# EAGLE design ice drifter 6 (EAGLE 9.3.1)
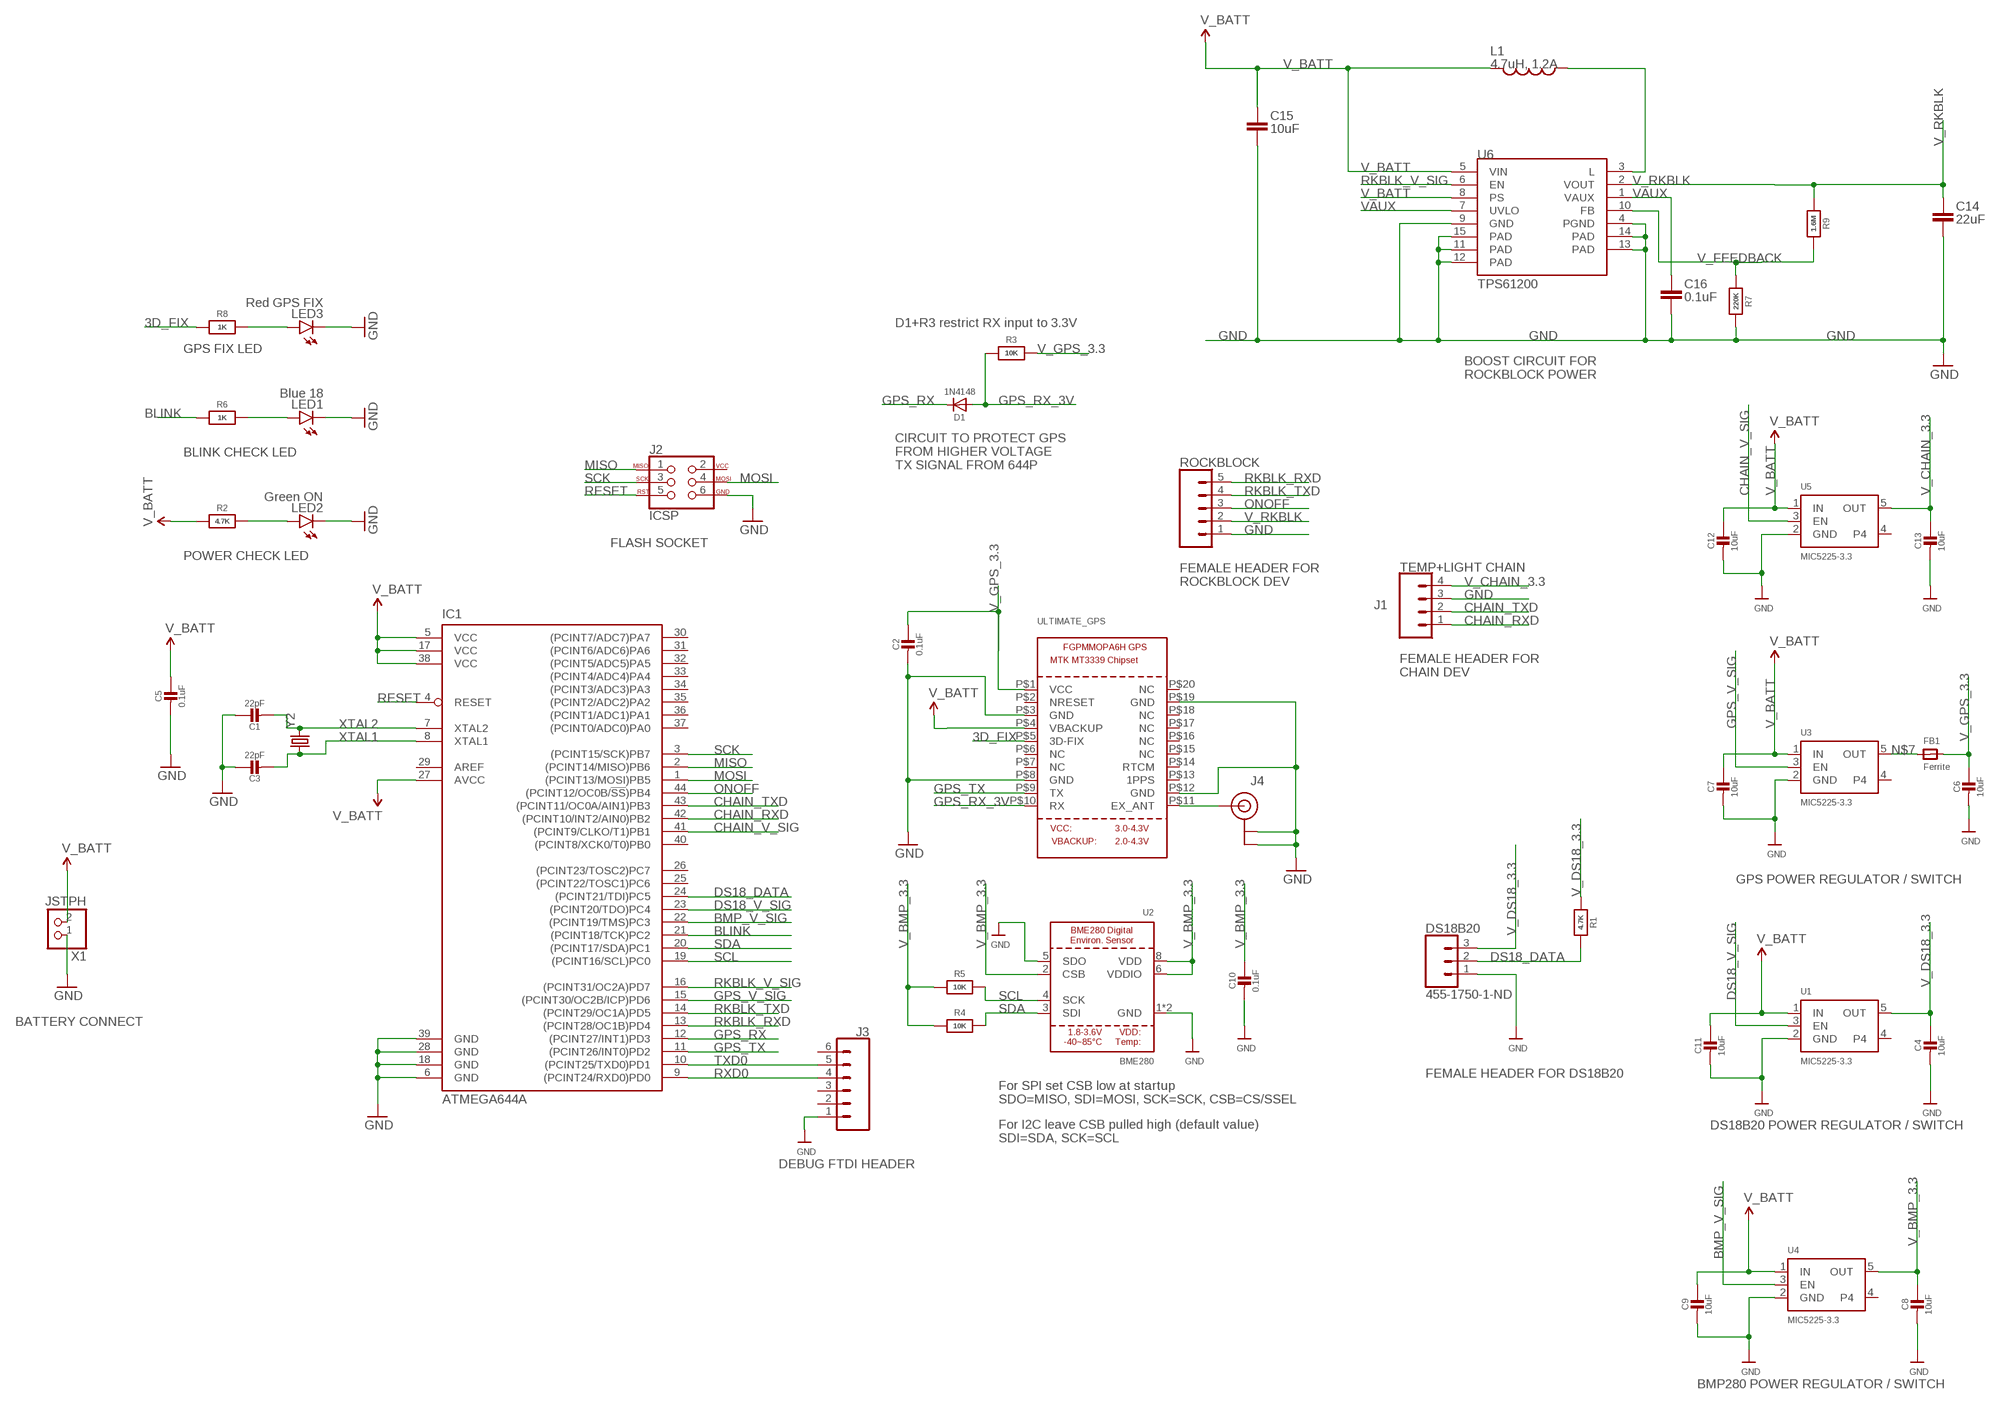
[diagram p0: schematic, sheet 1]

## Parts
C1  22pF  CAP_CERAMIC0805-NOOUTLINE  [0805-NO@2]
C2  0.1uF  CAP_CERAMIC0805-NOOUTLINE  [0805-NO@2]
C3  22pF  CAP_CERAMIC0805-NOOUTLINE  [0805-NO@2]
C4  10uF  CAP_CERAMIC0805-NOOUTLINE  [0805-NO@2]
C5  0.1uF  CAP_CERAMIC0805-NOOUTLINE  [0805-NO@2]
C6  10uF  CAP_CERAMIC0805-NOOUTLINE  [0805-NO@2]
C7  10uF  CAP_CERAMIC0805-NOOUTLINE  [0805-NO@2]
C8  10uF  CAP_CERAMIC0805-NOOUTLINE  [0805-NO@2]
C9  10uF  CAP_CERAMIC0805-NOOUTLINE  [0805-NO@2]
C10  0.1uF  CAP_CERAMIC0805-NOOUTLINE  [0805-NO@2]
C11  10uF  CAP_CERAMIC0805-NOOUTLINE  [0805-NO@2]
C12  10uF  CAP_CERAMIC0805-NOOUTLINE  [0805-NO@2]
C13  10uF  CAP_CERAMIC0805-NOOUTLINE  [0805-NO@2]
C14  22uF  CAP0805  [0805]
C15  10uF  CAP1206  [1206]
C16  0.1uF  CAP0805  [0805]
D1  1N4148  DIODESOD-323  [SOD-323]
DS18B20  455-1750-1-ND  CONN_03  [1X03]
FB1  Ferrite  FERRITE-0805NO  [0805-NO@1]
IC1  ATMEGA644A  [TQFP44]
J1  TEMP+LIGHT CHAIN  CONN_04  [1X04]
J2  ICSP  AVR_SPI_PROG_3X2NS  [2X3-NS]
J3  CONN_06SILK_FEMALE_PTH  [1X06]
J4  U.FL  [U.FL]
L1  4.7uH, 1.2A  INDUCTOR.  [CDRH2D09]
LED1  Blue 18  LED1206  [LED-1206]
LED2  Green ON  LED1206  [LED-1206]
LED3  Red GPS FIX  LED1206  [LED-1206]
R1  4.7K  RESISTOR0805_NOOUTLINE  [0805-NO]
R2  4.7K  RESISTOR0805_NOOUTLINE  [0805-NO]
R3  10K  RESISTOR0805_NOOUTLINE  [0805-NO]
R4  10K  RESISTOR0805_NOOUTLINE  [0805-NO]
R5  10K  RESISTOR0805_NOOUTLINE  [0805-NO]
R6  1K  RESISTOR0805_NOOUTLINE  [0805-NO]
R7  220K  RESISTOR0805_NOOUTLINE  [0805-NO]
R8  1K  RESISTOR0805_NOOUTLINE  [0805-NO]
R9  1.6M  RESISTOR0805_NOOUTLINE  [0805-NO]
ROCKBLOCK  CONN_05  [1X05]
U1  MIC5225-3.3  VREG_SOT23-5  [SOT23-5]
U2  BME280  [BME280]
U3  MIC5225-3.3  VREG_SOT23-5  [SOT23-5]
U4  MIC5225-3.3  VREG_SOT23-5  [SOT23-5]
U5  MIC5225-3.3  VREG_SOT23-5  [SOT23-5]
U6  TPS61200  [QFN-10_PAD]
ULTIMATE_GPS  GPS_FGPMMOPA6H  [FGPMMOPA6H]
X1  JSTPH  CON_JST_PH_2PIN  [JSTPH2]
Y2  CRYSTALTXC-7A  [CRYSTAL-TXC-7A]

## Nets
3D_FIX: R8.1 ULTIMATE_GPS.P$5(3D-FIX)
BLINK [signal]: IC1.21((PCINT18/TCK)PC2) R6.1
BMP_V_SIG [signal]: IC1.22((PCINT19/TMS)PC3) U4.3(EN)
CHAIN_RXD [signal]: IC1.42((PCINT10/INT2/AIN0)PB2) J1.1
CHAIN_TXD [signal]: IC1.43((PCINT11/OC0A/AIN1)PB3) J1.2
CHAIN_V_SIG [signal]: IC1.41((PCINT9/CLKO/T1)PB1) U5.3(EN)
COIL: L1.P$1 U6.3(L)
DS18_DATA [signal]: DS18B20.2 IC1.24((PCINT21/TDI)PC5) R1.2
DS18_V_SIG [signal]: IC1.23((PCINT20/TDO)PC4) U1.3(EN)
GND [ground]: C1.1 C2.2 C3.1 C4.2 C5.2 C6.2 C7.2 C8.2 C9.2 C10.2 C11.2 C12.2 C13.2 C14.2 C15.2 C16.2 DS18B20.1 IC1.6(GND) IC1.18(GND) IC1.28(GND) IC1.39(GND) J1.3 J2.6 J3.1 J4.1(GND) J4.2(GND) LED1.C LED2.C LED3.C R7.2 ROCKBLOCK.1 U1.2(GND) U2.1(GND) U2.5(SDO) U2.7(GND) U3.2(GND) U4.2(GND) U5.2(GND) U6.4(PGND) U6.9(GND) U6.11(PAD) U6.12(PAD) U6.13(PAD) U6.14(PAD) U6.15(PAD) ULTIMATE_GPS.P$3(GND) ULTIMATE_GPS.P$8(GND) ULTIMATE_GPS.P$12(GND) ULTIMATE_GPS.P$19(GND) X1.1
GPS_RX [signal]: D1.C IC1.12((PCINT27/INT1)PD3)
GPS_RX_3V: D1.A R3.1 ULTIMATE_GPS.P$10(RX)
GPS_TX [signal]: IC1.11((PCINT26/INT0)PD2) ULTIMATE_GPS.P$9(TX)
GPS_V_SIG [signal]: IC1.15((PCINT30/OC2B/ICP)PD6) U3.3(EN)
MISO [signal]: IC1.2((PCINT14/MISO)PB6) J2.1
MOSI [signal]: IC1.1((PCINT13/MOSI)PB5) J2.4
N$1: LED2.A R2.2
N$2 [signal]: LED1.A R6.2
N$3: LED3.A R8.2
N$7: FB1.1 U3.5(OUT)
ONOFF [signal]: IC1.44((PCINT12/OC0B/!SS!)PB4) ROCKBLOCK.3
RESET [signal]: IC1.4(RESET) J2.5
RKBLK_RXD [signal]: IC1.13((PCINT28/OC1B)PD4) ROCKBLOCK.5
RKBLK_TXD [signal]: IC1.14((PCINT29/OC1A)PD5) ROCKBLOCK.4
RKBLK_V_SIG [signal]: IC1.16((PCINT31/OC2A)PD7) U6.6(EN)
RXD0 [signal]: IC1.9((PCINT24/RXD0)PD0) J3.4
SCK [signal]: IC1.3((PCINT15/SCK)PB7) J2.3
SCL [signal]: IC1.19((PCINT16/SCL)PC0) R5.2 U2.4(SCK)
SDA [signal]: IC1.20((PCINT17/SDA)PC1) R4.2 U2.3(SDI)
TXD0 [signal]: IC1.10((PCINT25/TXD0)PD1) J3.5
U.FL_ANT: J4.FEED(SIGNAL) ULTIMATE_GPS.P$11(EX_ANT)
V_BATT: C5.1 C7.1 C9.1 C11.1 C12.1 C15.1 IC1.5(VCC) IC1.17(VCC) IC1.27(AVCC) IC1.38(VCC) L1.P$2 R2.1 U1.1(IN) U3.1(IN) U4.1(IN) U5.1(IN) U6.5(VIN) U6.8(PS) ULTIMATE_GPS.P$4(VBACKUP) X1.2
V_BMP_3.3: C8.1 C10.1 R4.1 R5.1 U2.2(CSB) U2.6(VDDIO) U2.8(VDD) U4.5(OUT)
V_CHAIN_3.3: C13.1 J1.4 U5.5(OUT)
V_DS18_3.3: C4.1 DS18B20.3 R1.1 U1.5(OUT)
V_FEEDBACK: R7.1 R9.2 U6.10(FB)
V_GPS_3.3: C2.1 C6.1 FB1.2 R3.2 ULTIMATE_GPS.P$1(VCC)
V_RKBLK: C14.1 R9.1 ROCKBLOCK.2 U6.2(VOUT)
VAUX: C16.1 U6.1(VAUX) U6.7(UVLO)
XTAL1 [signal]: C3.2 IC1.8(XTAL1) Y2.P$1
XTAL2 [signal]: C1.2 IC1.7(XTAL2) Y2.P$2
Unconnected: IC1.25((PCINT22/TOSC1)PC6) IC1.26((PCINT23/TOSC2)PC7) IC1.29(AREF) IC1.30((PCINT7/ADC7)PA7) IC1.31((PCINT6/ADC6)PA6) IC1.32((PCINT5/ADC5)PA5) IC1.33((PCINT4/ADC4)PA4) IC1.34((PCINT3/ADC3)PA3) IC1.35((PCINT2/ADC2)PA2) IC1.36((PCINT1/ADC1)PA1) IC1.37((PCINT0/ADC0)PA0) IC1.40((PCINT8/XCK0/T0)PB0) J2.2 J3.2 J3.3 J3.6 U1.4 U3.4 U4.4 U5.4 ULTIMATE_GPS.P$2(NRESET) ULTIMATE_GPS.P$6(NC) ULTIMATE_GPS.P$7(NC) ULTIMATE_GPS.P$13(1PPS) ULTIMATE_GPS.P$14(RTCM) ULTIMATE_GPS.P$15(NC) ULTIMATE_GPS.P$16(NC) ULTIMATE_GPS.P$17(NC) ULTIMATE_GPS.P$18(NC) ULTIMATE_GPS.P$20(NC)

## Notes on the sheet
- D1+R3 restrict RX input to 3.3V
- GPS FIX LED
- BOOST CIRCUIT FOR 
  ROCKBLOCK POWER
- BLINK CHECK LED
- CIRCUIT TO PROTECT GPS 
  FROM HIGHER VOLTAGE 
  TX SIGNAL FROM 644P
- FLASH SOCKET
- POWER CHECK LED
- FEMALE HEADER FOR 
  ROCKBLOCK DEV
- FEMALE HEADER FOR 
  CHAIN DEV
- GPS POWER REGULATOR / SWITCH
- BATTERY CONNECT
- FEMALE HEADER FOR DS18B20
- For SPI set CSB low at startup
  SDO=MISO, SDI=MOSI, SCK=SCK, CSB=CS/SSEL
- DS18B20 POWER REGULATOR / SWITCH
- For I2C leave CSB pulled high (default value)
  SDI=SDA, SCK=SCL
- DEBUG FTDI HEADER
- BMP280 POWER REGULATOR / SWITCH

## Library data of the parts
C1-C13 = microbuilder:CAP_CERAMIC: Ceramic Capacitors For new designs, use the packages preceded by an '_' character since they are more reliable: The following footprints should be used on most boards: _0402 - Standard footprint for regular board layouts _0603 - Standard footprint for regular board layouts _0805 - Standard footprint for regular board layouts _1206 - Standard footprint for regular board layouts For extremely tight-pitch boards where space is at a premium, the following 'micro-pitch' footprints can be used (smaller pads, no silkscreen outline, etc.): _0402MP - Micro-pitch footprint for very dense/compact boards _0603MP - Micro-pitch footprint for very dense/compact boards _0805MP - Micro-pitch footprint for very dense/compact boards _1206MP - Micro-pitch footprint for very dense/compact boards
C14-C16 = CH_passive:CAP: Capacitor Standard 0603 ceramic capacitor, and 0.1" leaded capacitor.
D1 = microbuilder:DIODE: Diode SMA Model Volts Amps Type Vf Ir Digikey # Notes SSA34-E3 40V 3A Schottky 480mV @ 3A 200uA @ 40V SSA34-E3/61TGITR-ND CDBA120-G 20V 1A Schottky 500mV @ 1A 500uA @ 20V 641-1014-6-ND REEL MBRA210 10V 2A Schottky 350mV @ 2A 700uA @ 10V MBRA210LT3 SOD-123 Model Volts Amps Type Vf Ir Order # Notes BAT54T1G 30V 200mA Schottky 800mV @ 200mA 2uA @ 25V BAT54T1GOSTR-ND B0530W 30V 500mA Schottky 430mV @ 500mA 130uA @ 30V B0530W-FDICT-ND REEL MBR120 20V 1A Schottky 340mV @ 1A MBR120VLSFT1GOSCT-ND SOD-323 Model Volts Amps Type Vf Ir Order # Notes PMEG2005EJ 20V 500mA Schottky 355mV @ 500mA 568-4110-1-ND ZLLS410 10V 570mA Schottky 380mV @ 570mA ZLLS410CT-ND 1N4148WS 75V 150mA Silicon/Simple 1V 1N4148WSFSCT-ND REEL SOD-523 Model Volts Amps Type Vf Ir Order # Notes BAT54XV2 30V 200mA Schottky 0.8V @ 100mA BAT54XV2CT-ND TB751S 30V 30mA Schottky RB751S-40TE61CT-ND SOT23-R/W (R = Solder Paste/Reflow Ovens, W = Hand-Soldering) Model Volts Amps Type Vf Ir Order # Notes BAT54FILM 40V 300mA Schottky 497-7162-1-ND POWERDI-5 Model Volts Amps Type Vf Ir Order # Notes PDS560 60V 5A Schottky 670mV @ 5A 150uA @ 60V PDS560DICT-ND
DS18B20 = SparkFun-Connectors:CONN_03: Multi connection point. Often used as Generic Header-pin footprint for 0.1 inch spaced/style header connections On any of the 0.1 inch spaced packages, you can populate with these: Break Away Headers - Straight <https://www.sparkfun.com/products/116> (PRT-00116) Break Away Male Headers - Right Angle <https://www.sparkfun.com/products/553> (PRT-00553) Female Headers <https://www.sparkfun.com/products/115> (PRT-00115) Break Away Headers - Machine Pin <https://www.sparkfun.com/products/117> (PRT-00117) Break Away Female Headers - Swiss Machine Pin <https://www.sparkfun.com/products/743> (PRT-00743) Stackable Header - 3 Pin (Female, 0.1") <https://www.sparkfun.com/products/13875> (PRT-13875) For SCREWTERMINALS and SPRING TERMINALS visit here: Screw Terimnals on SparkFun.com <https://www.sparkfun.com/search/results?term=Screw+Terminals> (5mm/3.5mm/2.54mm spacing) This device is also useful as a general connection point to wire up your design to another part of your project. Our various solder wires solder well into these plated through hole pads. Hook-Up Wire - Assortment (Stranded, 22 AWG) <https://www.sparkfun.com/products/11375> (PRT-11375) Hook-Up Wire - Assortment (Solid Core, 22 AWG) <https://www.sparkfun.com/products/11367> (PRT-11367) View the entire wire category on our website here <https://www.sparkfun.com/categories/141> Special notes: Molex polarized connector foot print use with SKU : PRT-08232 with associated crimp pins and housings.; PROD_ID: XXX-00000
FB1 = microbuilder:FERRITE: Ferrite Bead 0603 MMZ1608B121C - 120 Ohm @ 100MHz, 600mA, 0.15 Ohm DC Resistance - Digikey: 445-2164-1-ND BK1608HW121-T - 120 Ohm, 600mA Ferrite Chip - Digikey: 587-1876-2-ND 0805 HZ0805B272R-10 - 2.7K Ohm @ 100MHz, 200mA, 0.8 Ohm DC Resistance - Digikey: 240-2504-1-ND (see also Murata BLM21BD272SN1L) MMZ2012Y152B - 1.5K Ohm @ 100MHz, 500mA, 0.4 Ohm DC Resistance - Digikey: 445-1560-1-ND - Mainly for high frequency (80-400MHz) MMZ2012R102A - 1K Ohm @ 100MHz, 500mA, 0.3 Ohm DC Resistance - Digikey: 445-1555-2-ND - More general purpose (10-200MHz)
IC1 = atmel:ATMEGA644: 8-bit Microcontroller with 64K Bytes In-System Programmable Flash Source: http://www.atmel.com/dyn/resources/prod_documents/doc2593.pdf; MPN: ATMEGA644PV-10AU; OC_FARNELL: 1455123; OC_NEWARK: 58M3748
J1 = SparkFun-Connectors:CONN_04: Multi connection point. Often used as Generic Header-pin footprint for 0.1 inch spaced/style header connections On any of the 0.1 inch spaced packages, you can populate with these: Break Away Headers - Straight <https://www.sparkfun.com/products/116> (PRT-00116) Break Away Male Headers - Right Angle <https://www.sparkfun.com/products/553> (PRT-00553) Female Headers <https://www.sparkfun.com/products/115> (PRT-00115) Break Away Headers - Machine Pin <https://www.sparkfun.com/products/117> (PRT-00117) Break Away Female Headers - Swiss Machine Pin <https://www.sparkfun.com/products/743> (PRT-00743) For SCREWTERMINALS and SPRING TERMINALS visit here: Screw Terimnals on SparkFun.com <https://www.sparkfun.com/search/results?term=Screw+Terminals> (5mm/3.5mm/2.54mm spacing) This device is also useful as a general connection point to wire up your design to another part of your project. Our various solder wires solder well into these plated through hole pads. Hook-Up Wire - Assortment (Stranded, 22 AWG) <https://www.sparkfun.com/products/11375> (PRT-11375) Hook-Up Wire - Assortment (Solid Core, 22 AWG) <https://www.sparkfun.com/products/11367> (PRT-11367) View the entire wire category on our website here <https://www.sparkfun.com/categories/141> Special notes: Molex polarized connector foot print use with SKU : PRT-08231 with associated crimp pins and housings. 1MM SMD Version SKU: PRT-10208; PROD_ID: CONN-09696
J2 = SparkFun-Connectors:AVR_SPI_PROG_3X2: AVR ISP 6 Pin This is the reduced ISP connector for AVR programming. Common on Arduino. This footprint will take up less PCB space and can be used with a 10-pin to 6-pin adapter such as SKU: BOB-08508 **Special note about "TEST_POINT" package. The stop mask is on the top side, so if you want your programming test points to be on the bottom of your board, make sure to place this package on the bottom side of the board. This also ensure that the orientation to program from the bottom side will be correct. SparkFun Products: SparkFun ISP Pogo Adapter <https://www.sparkfun.com/products/11591> - NS Tiny AVR Programmer <https://www.sparkfun.com/products/11801> -PTH
J3 = SparkFun-Connectors:CONN_06: Multi connection point. Often used as Generic Header-pin footprint for 0.1 inch spaced/style header connections On any of the 0.1 inch spaced packages, you can populate with these: Break Away Headers - Straight <https://www.sparkfun.com/products/116> (PRT-00116) Break Away Male Headers - Right Angle <https://www.sparkfun.com/products/553> (PRT-00553) Female Headers <https://www.sparkfun.com/products/115> (PRT-00115) Break Away Headers - Machine Pin <https://www.sparkfun.com/products/117> (PRT-00117) Break Away Female Headers - Swiss Machine Pin <https://www.sparkfun.com/products/743> (PRT-00743) Arduino Stackable Header - 6 Pin <https://www.sparkfun.com/products/9280> (PRT-09280) For SCREWTERMINALS and SPRING TERMINALS visit here: Screw Terimnals on SparkFun.com <https://www.sparkfun.com/search/results?term=Screw+Terminals> (5mm/3.5mm/2.54mm spacing) This device is also useful as a general connection point to wire up your design to another part of your project. Our various solder wires solder well into these plated through hole pads. Hook-Up Wire - Assortment (Stranded, 22 AWG) <https://www.sparkfun.com/products/11375> (PRT-11375) Hook-Up Wire - Assortment (Solid Core, 22 AWG) <https://www.sparkfun.com/products/11367> (PRT-11367) View the entire wire category on our website here <https://www.sparkfun.com/categories/141>; PROD_ID: CONN-08437
J4 = SparkFun-Connectors:U.FL: SMD Antenna Connector - U.FL 2mm height, 3.0mm x 3.0mm receptacle size. SparkFun Products: SparkFun WiFi Shield - ESP8266 <https://www.sparkfun.com/products/13287> SparkFun ESP8266 Thing <https://www.sparkfun.com/products/13231> SparkFun MiniGen - Pro Mini Signal Generator Shield <https://www.sparkfun.com/products/11420>; PROD_ID: CONN-09193; SF_ID: WRL-09144
L1 = SparkFun:INDUCTOR: Inductors Basic Inductor/Choke - 0603 and 1206. Footprints are not proven and vary greatly between part numbers.
LED1 LED3 = SparkFun-LED:LED: LEDs Standard schematic elements and footprints for 5mm, 3mm, 1206, and 0603 sized LEDs. 5mm - Spark Fun Electronics SKU : COM-00529 (and others); PROD_ID: DIO-09911
LED2 = SparkFun-LED:LED: LEDs Standard schematic elements and footprints for 5mm, 3mm, 1206, and 0603 sized LEDs. 5mm - Spark Fun Electronics SKU : COM-00529 (and others); PROD_ID: DIO-09910
R1-R9 = microbuilder:RESISTOR: Resistors For new designs, use the packages preceded by an '_' character since they are more reliable: The following footprints should be used on most boards: _0402 - Standard footprint for regular board layouts _0603 - Standard footprint for regular board layouts _0805 - Standard footprint for regular board layouts _1206 - Standard footprint for regular board layouts For extremely tight-pitch boards where space is at a premium, the following 'micro-pitch' footprints can be used (smaller pads, no silkscreen outline, etc.): _0402MP - Micro-pitch footprint for very dense/compact boards _0603MP - Micro-pitch footprint for very dense/compact boards _0805MP - Micro-pitch footprint for very dense/compact boards _1206MP - Micro-pitch footprint for very dense/compact boards
ROCKBLOCK = SparkFun-Connectors:CONN_05: Multi connection point. Often used as Generic Header-pin footprint for 0.1 inch spaced/style header connections On any of the 0.1 inch spaced packages, you can populate with these: Break Away Headers - Straight <https://www.sparkfun.com/products/116> (PRT-00116) Break Away Male Headers - Right Angle <https://www.sparkfun.com/products/553> (PRT-00553) Female Headers <https://www.sparkfun.com/products/115> (PRT-00115) Break Away Headers - Machine Pin <https://www.sparkfun.com/products/117> (PRT-00117) Break Away Female Headers - Swiss Machine Pin <https://www.sparkfun.com/products/743> (PRT-00743) For SCREWTERMINALS and SPRING TERMINALS visit here: Screw Terimnals on SparkFun.com <https://www.sparkfun.com/search/results?term=Screw+Terminals> (5mm/3.5mm/2.54mm spacing) This device is also useful as a general connection point to wire up your design to another part of your project. Our various solder wires solder well into these plated through hole pads. Hook-Up Wire - Assortment (Stranded, 22 AWG) <https://www.sparkfun.com/products/11375> (PRT-11375) Hook-Up Wire - Assortment (Solid Core, 22 AWG) <https://www.sparkfun.com/products/11367> (PRT-11367) View the entire wire category on our website here <https://www.sparkfun.com/categories/141> Special notes: Molex polarized connector foot print use with SKU : PRT-08231 with associated crimp pins and housings. 1MM SMD Version SKU: PRT-10208
U1 U3-U5 = microbuilder:VREG_SOT23-5: SOT23-5 Fixed Voltage Regulators Part Current Out V Out V In V Dropout θJA (°C/W) TJ (°C) Digikey Part No. ADP121 150mA 3.3V 3.4-5.5V 0.09V @ 150mA -- -- ADP121-AUJZ33R7CT-ND ADP121 150mA 3.0V 3.1-5.5V 0.09V @ 150mA -- -- ADP121-AUJZ30R7CT-ND ADP122 300mA 3.3V 3.4-5.5V 0.085V @ 300mA -- -- ADP122AUJZ-3.3-R7CT-ND ADP1712 300mA 3.3V 3.5-5.5V 0.17V @ 300mA -- -- ADP1712AUJZ-3.3-R7TR-ND AP7311 (Low Cost) 150mA 3.3V 3.5-6V 0.15V @ 150mA -- -- AP7311-33WG-7DICT-ND LD39015M18R 150mA 1.8V 1.9V-5.5V 0.08V @ 100mA -- -- 497-6977-1-ND LP2985A-33DBVR 150mA 3.3V 3.3-16V 0.28V @ 150mA 206 150 296-18479-1-ND MCP1824T-3302E/OT 300mA 3.3V 3.5V-6V 0.2V @ 300mA -- -- MCP1824T-3302E/OTCT-ND MIC5205-2.5YM5 TR 150mA 2.5V 2.7-16V 0.165V @ 150mA -- -- 576-1257-2-ND MIC5205-3.0YM5 TR 150mA 3.0V 3.2V-16V 0.165V @ 150mA -- -- 576-1258-2-ND MIC5205-3.3YM5 TR 150mA 3.3V 3.5V-16V 0.165V @ 150mA -- -- 576-1259-2-ND TPS780330220 150mA 3.3V+2.2V 3.6-5.5V 250mV Max -- -- 296-23332-1-ND TDA3663/N1,135 100mA 3.3V 3.5-45V 0.18V @ 50mA -- -- 568-5343-1-ND Max operating temp can be calculated using θJA, TJ (max junction temperature), and power in watts. Set the "Maximum Ambient Temperature" until it reaches TJ ("Max Junction Temperature"), which is the absolute limit for safe use of the regulator: Heat Sink Temperature Calculator <http://www.daycounter.com/Calculators/Heat-Sink-Temperature-Calculator.phtml> For example, With 12V source into a 3.3V LP2985 and a 30mA load, we are dissipating (12V-3.3V) * 0.03A = 0.261W. With a θJA of 206 °C/W, a TJ of 150°C, and 261mW we can safely use the chip without a heat sink up to 75°C (=147.1°C Junction Temperature).
U2 = microbuilder:BME280: BME280 - Environmental Sensor (I2C + SPI)
U6 = SparkFun:TPS61200: DC to DC Booster
ULTIMATE_GPS = adafruit:GPS_FGPMMOPA6H: GPS Module - MTK MT3339 Chipset, -165dBm sensitivity, 22 channels, 10Hz, auto-select external antenna options
X1 = microbuilder:CON_JST_PH_2PIN: JST 2-Pin Right-Angle Connector PH-Series - 4UConnector: 17311 SH-Series - 4UConnector: 07278
Y2 = SparkFun-FreqCtrl:CRYSTAL: Various standard crystals. Proven footprints.

## Net classes
0 power: width 0.406 mm, clearance 0.508 mm
1 ground: width 0.406 mm, clearance 0.508 mm
2 signal: width 0.305 mm, clearance 0.508 mm
3 signal+: width 0.406 mm

## Board
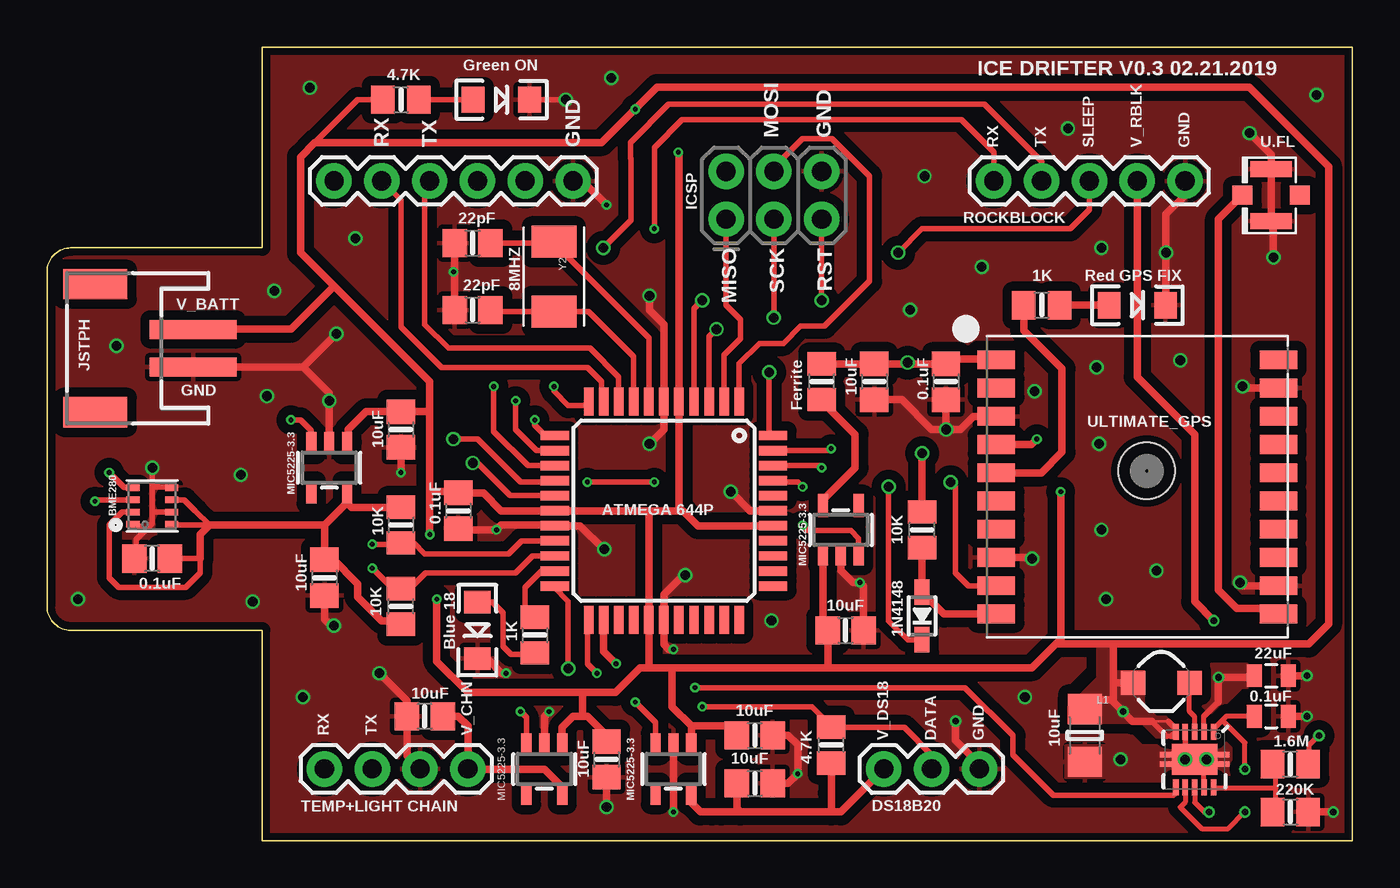
[diagram p1: board, top side]
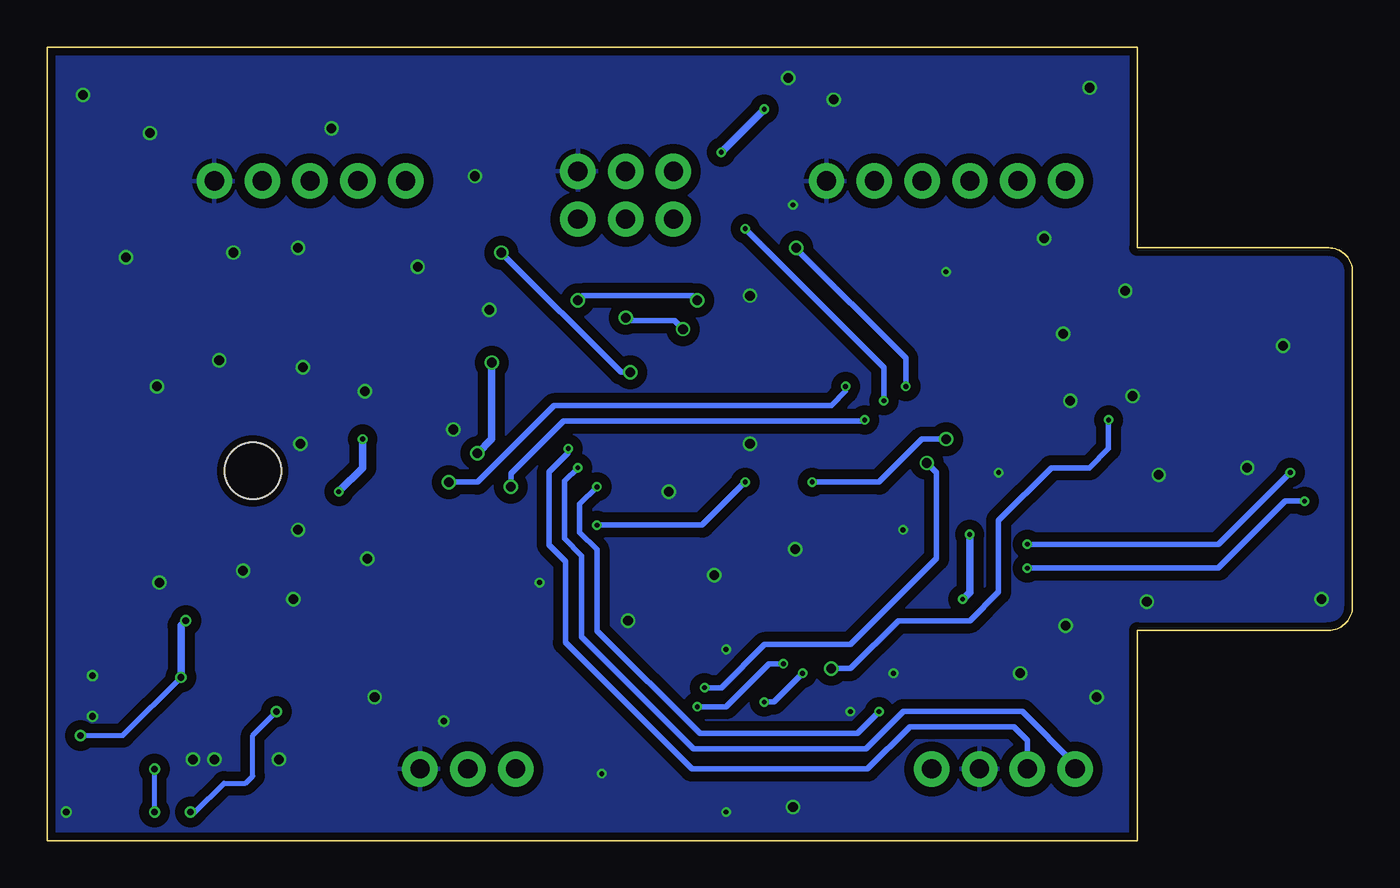
[diagram p2: board, bottom side, seen from below]

Size 69.34 x 42.16 mm. Coordinates in mm from the lower left corner, seen from the top.
Outline: 0,30.23 0,12.45 arc90 1.27,11.18 11.43,11.18 11.43,0 69.34,0 69.34,42.16 11.43,42.16 11.43,31.5 1.27,31.5 arc90 0,30.23
Copper layers (1*16): Top 0.035559375mm / dielectric 1.6mm / Bottom 0.035559375mm
Design rules "oshpark-2layer": minimum track width 6mil, minimum drill 10mil, track to track 6mil, track to pad 6mil, pad to pad 6mil, via to via 6mil, smd to smd 6mil, copper to edge 15mil, drill to drill 6mil, minimum pad ring 5mil, minimum via ring 5mil, stop-mask expansion 2.5mil, vias tented up to drill 0mil, thermal gap 10mil

### Footprints (pad centres in the part's own frame; a part is rotated, then mirrored left to right if it is on the bottom)
0805-NO@2 = smd 1.3 x 1.5: 1 -0.95,0; 2 0.95,0
0805 = smd 0.8 x 1.2: 1 -0.9,0; 2 0.9,0
1206 = smd 1.6 x 1.8: 1 -1.4,0; 2 1.4,0
SOD-323 = smd 1.35 x 0.8: A 1.27,0; C -1.27,0
1X03 = drill 1.016 pad 1.88: 1 0,0; 2 2.54,0; 3 5.08,0
0805-NO@1 = smd 1.24 x 1.5: 1 -0.95,0; 2 0.95,0
TQFP44 = smd 1.5 x 0.5: 1 -5.8,4; 2 -5.8,3.2; 3 -5.8,2.4; 4 -5.8,1.6; 5 -5.8,0.8; 6 -5.8,0; 7 -5.8,-0.8; 8 -5.8,-1.6; 9 -5.8,-2.4; 10 -5.8,-3.2; 11 -5.8,-4; 23 5.8,-4; 24 5.8,-3.2; 25 5.8,-2.4; 26 5.8,-1.6; 27 5.8,-0.8; 28 5.8,0; 29 5.8,0.8; 30 5.8,1.6; 31 5.8,2.4; 32 5.8,3.2; 33 5.8,4 | smd 0.5 x 1.5: 12 -4,-5.8; 13 -3.2,-5.8; 14 -2.4,-5.8; 15 -1.6,-5.8; 16 -0.8,-5.8; 17 0,-5.8; 18 0.8,-5.8; 19 1.6,-5.8; 20 2.4,-5.8; 21 3.2,-5.8; 22 4,-5.8; 34 4,5.8; 35 3.2,5.8; 36 2.4,5.8; 37 1.6,5.8; 38 0.8,5.8; 39 0,5.8; 40 -0.8,5.8; 41 -1.6,5.8; 42 -2.4,5.8; 43 -3.2,5.8; 44 -4,5.8
1X04 = drill 1.016 pad 1.88: 1 0,0; 2 2.54,0; 3 5.08,0; 4 7.62,0
2X3-NS = drill 1.016 pad 1.88: 1 -2.54,-1.27; 2 -2.54,1.27; 3 0,-1.27; 4 0,1.27; 5 2.54,-1.27; 6 2.54,1.27
1X06 = drill 1.016 pad 1.88: 1 0,0; 2 2.54,0; 3 5.08,0; 4 7.62,0; 5 10.16,0; 6 12.7,0
U.FL = smd 2.2 x 0.85: 1 0,1.375; 2 0,-1.375 | smd 1.05 x 1: FEED 1.525,0; NC -1.525,0
CDRH2D09 = smd 1.3 x 1.3: P$1 -1.5,0; P$2 1.5,0
LED-1206 = smd 1.2 x 1.4: A -1.5,0; C 1.5,0
0805-NO = smd 1.24 x 1.5: 1 -0.95,0; 2 0.95,0
1X05 = drill 1.016 pad 1.88: 1 0,0; 2 2.54,0; 3 5.08,0; 4 7.62,0; 5 10.16,0
SOT23-5 = smd 0.55 x 1.2: 1 -0.95,-1.3; 2 0,-1.3; 3 0.95,-1.3; 4 0.95,1.3; 5 -0.95,1.3
BME280 = smd 0.7 x 0.35: 1 1.025,0.975; 2 1.025,0.325; 3 1.025,-0.325; 4 1.025,-0.975; 5 -1.025,-0.975; 6 -1.025,-0.325; 7 -1.025,0.325; 8 -1.025,0.975
QFN-10_PAD = smd 0.297 x 0.85: 1 -1,-1.475; 2 -0.5,-1.475; 3 0,-1.475; 4 0.5,-1.475; 5 1,-1.475; 6 1,1.475; 7 0.5,1.475; 8 0,1.475; 9 -0.5,1.475; 10 -1,1.475 | smd 0.7 x 0.28: 11 -1.5,0.25; 12 -1.5,-0.25; 13 1.5,0.25; 14 1.5,-0.25 | smd 2.4 x 1.65: 15 0,0
FGPMMOPA6H = smd 2 x 1: P$1 -7.5,6.75; P$2 -7.5,5.25; P$3 -7.5,3.75; P$4 -7.5,2.25; P$5 -7.5,0.75; P$6 -7.5,-0.75; P$7 -7.5,-2.25; P$8 -7.5,-3.75; P$9 -7.5,-5.25; P$10 -7.5,-6.75; P$11 7.5,-6.75; P$12 7.5,-5.25; P$13 7.5,-3.75; P$14 7.5,-2.25; P$15 7.5,-0.75; P$16 7.5,0.75; P$17 7.5,2.25; P$18 7.5,3.75; P$19 7.5,5.25; P$20 7.5,6.75 | hole 3: 0.5,0.85
JSTPH2 = smd 1 x 4.6: 1 -1,-3.7; 2 1,-3.7 | smd 1.6 x 3.4: NC1 -3.4,1.5; NC2 3.4,1.5
CRYSTAL-TXC-7A = smd 1.7 x 2.4: P$1 1.85,0; P$2 -1.85,0

### Placement (x,y rotation side)
C1  22.61,31.75 0 top
C2  47.75,24.38 270 top
C3  22.61,28.19 0 top
C4  37.59,3.05 0 top
C5  21.84,17.53 270 top
C6  43.94,24.38 270 top
C7  42.42,11.18 0 top
C8  14.73,13.97 270 top
C9  18.8,21.84 270 top
C10  5.59,14.99 180 top
C11  37.59,5.59 0 top
C12  29.72,4.32 270 top
C13  20.07,6.6 180 top
C14  65.02,8.76 0 top
C15  55.12,5.59 270 top
C16  65.02,6.6 0 top
D1  46.48,11.94 90 top
DS18B20  49.53,3.81 180 top
FB1  41.15,24.38 90 top
IC1  32.77,17.53 270 top
J1  14.73,3.81 0 top
J2  38.61,34.29 0 top
J3  27.94,35.05 180 top
J4  65.02,34.29 180 top
L1  59.18,8.38 180 top
LED1  22.86,11.18 270 top
LED2  24.13,39.37 0 top
LED3  57.91,28.45 0 top
R1  41.66,5.08 90 top
R2  18.8,39.37 0 top
R3  46.48,16.51 90 top
R4  18.8,12.45 90 top
R5  18.8,16.76 270 top
R6  25.91,10.92 270 top
R7  66.04,1.52 0 top
R8  52.83,28.45 0 top
R9  66.04,4.06 180 top
ROCKBLOCK  60.45,35.05 180 top
U1  33.27,3.81 180 top
U2  5.59,17.78 180 top
U3  42.16,16.51 0 top
U4  14.99,19.81 180 top
U5  26.42,3.81 180 top
U6  60.96,4.32 180 top
ULTIMATE_GPS  57.91,18.8 0 top
X1  4.06,26.16 90 top
Y2  26.92,29.97 270 top

### Tracks (layer width: path | path; a pad name or v marks a point on that pad's centre or on a via)
3D_FIX
  Top 0.406: ULTIMATE_GPS.P$5 52.82,19.55 53.91,20.64 53.91,25.08 51.88,27.11 R8.1
BLINK
  Top 0.305: IC1.21 26.26,14.33 25.4,13.46 25.4,12.38 R6.1
BMP_V_SIG  (via drill 0.25, 0.51)
  Top 0.305: IC1.22 26.92,13.48 27.69,12.72 v27.69,9.14 | U4.3 14.04,21.78 13.46,22.35 v12.95,22.35
  Bottom 0.305: v27.69,9.14 26.67,9.14 24.13,11.68 20.32,11.68 18.8,13.21 18.8,17.02 16,19.81 13.97,19.81 12.95,20.83 v12.95,22.35
CHAIN_RXD  (via drill 0.25)
  Top 0.305: IC1.42 41.03,19.93 v41.15,19.81
  Bottom 0.305: J1.1 14.73,4.06 17.53,6.86 23.85,6.86 25.83,4.88 35.01,4.88 40.95,10.82 40.95,15.13 41.86,16.05 41.86,19.1 v41.15,19.81
CHAIN_TXD  (via drill 0.25)
  Top 0.305: IC1.43 41.55,20.73 v41.66,20.83
  Bottom 0.305: J1.2 17.27,5.33 17.98,6.05 23.52,6.05 25.75,3.81 35.09,3.81 41.8,10.52 41.8,14.84 42.67,15.71 42.67,19.58 41.66,20.6 v41.66,20.83
CHAIN_V_SIG  (via drill 0.25)
  Top 0.305: v25.15,6.86 25.47,6.54 U5.3 | IC1.41 38.64,19.05 39.88,19.05 v40.13,18.8
  Bottom 0.305: v25.15,6.86 25.15,6.84 26.29,5.69 34.67,5.69 40.13,11.15 40.13,15.47 41.05,16.39 41.05,17.88 v40.13,18.8
COIL
  Top 0.254: U6.3 60.96,6.58 60.68,6.86 L1.P$1
DS18_DATA  (via drill 0.25)
  Top 0.305: v34.8,7.11 40.64,7.11 41.66,6.1 R1.2 45.53,6.03 46.99,4.57 DS18B20.2
  Top 0.406: IC1.24 29.57,10.06 v30.23,9.4
  Bottom 0.305: v30.23,9.4 30.99,9.4 33.27,7.11 v34.8,7.11
DS18_V_SIG  (via drill 0.25)
  Top 0.305: IC1.23 28.7,11.66 28.7,9.4 v29.21,8.89 | v31.24,7.37 32.32,6.28 U1.3
  Bottom 0.305: v31.24,7.37 30.73,7.37 v29.21,8.89
GND  (via drill 0.25, 0.35, 0.51)
  Top 0.254: v61.59,4.32 61.46,4.18 U6.9
  Top 0.305: 5.59,17.46 5.59,18.8 | 5.59,18.8 v5.59,19.81 | U2.7 5.59,17.46 | U2.5 6.57,18.8 5.59,18.8 | 5.16,16.43 4.74,16 4.74,15.09 | 5.16,16.43 5.59,16.85 5.59,17.46 | U2.1 4.79,16.8 5.16,16.43 | LED2.C v27.56,39.37 | U6.4 v60.46,4.33
  Top 0.406: IC1.39 37.34,17.53 v36.32,18.54 | v33.91,14.1 33.78,14.1 32.77,13.08 IC1.28 32.77,10.41 33.02,10.16 v33.27,10.16 | v29.59,15.49 29.55,15.49 28.32,16.73 IC1.18 26.93,16.76 24.13,16.76 v23.88,16.51 21.91,16.51 C5.2 | v32,21.08 32.77,21.84 IC1.6 32.77,27.43 32,28.19 v32,28.96 | ULTIMATE_GPS.P$19 63.58,24.05 v63.5,24.13 | ULTIMATE_GPS.P$8 52.26,15.05 v52.32,14.99 | U3.2 42.16,14.36 42.8,13.72 v43.18,13.72 43.37,13.53 C7.2 | v47.75,21.84 46.99,21.84 45.4,23.43 C6.2 | v24.38,8.89 24.15,8.89 23.37,9.68 LED1.C | C10.2 4.74,15.09 | v47.75,21.84 C2.2 | v47.75,21.84 48.51,21.84 49.22,22.55 ULTIMATE_GPS.P$3 | C3.1 21.66,30.16 v21.59,30.23 21.66,30.29 C1.1 | X1.1 13.61,25.16 | 13.61,25.16 v15.37,26.92 | U4.2 v14.99,23.37 14.99,23.78 13.61,25.16 | v29.72,1.78 C12.2 | U5.2 26.42,6.6 v26.67,6.86 | C8.2 14.73,11.75 15.05,11.43 v15.24,11.43 | C4.2 39.37,3.05 v39.88,3.56 39.88,5.08 39.37,5.59 C11.2 | U1.2 v33.27,1.52 | J1.3 19.12,4.51 C13.2 19.12,7.43 v17.65,8.89 | ULTIMATE_GPS.P$12 63.54,13.55 v63.37,13.72 | LED3.C 59.44,28.47 v59.44,31.24 59.44,33.27 60.45,34.29 ROCKBLOCK.1 | v63.88,37.59 65.02,36.45 J4.2 J4.1 65.15,32.79 v65.15,30.99 | J3.1 28.45,35.05 v29.72,33.78 | C9.2 v18.8,19.56 | DS18B20.1 49.53,4.06 48.26,5.33 v48.26,6.35 | v60.46,4.33 v60.45,4.32 | v66.93,8.76 C14.2 | v66.93,6.6 C16.2 | v68.33,1.52 R7.2
  other vias: 38.48,11.68 58.93,14.35 13.97,40.01 56.01,16.51 55.75,25.15 45.85,28.19 11.68,23.62 12.07,29.21 54.23,37.85 46.61,35.31 16.38,32 13.59,7.62 49.66,30.48 67.44,39.62 60.2,25.53 10.29,19.43 10.92,12.7 57.02,4.32 52.45,23.88 29.97,40.51 1.65,12.83 3.68,26.29 55.88,21.08 56.01,31.5 56.26,12.83 51.94,7.62
  pour Top (rank 2): 1.27,31.5 11.43,31.5 11.43,42.16 69.34,42.16 69.34,0 11.43,0 11.43,11.18 1.27,11.18 arc-90 0,12.45 0,30.23 arc-90
  pour Bottom: 1.27,31.5 11.43,31.5 11.43,42.16 69.34,42.16 69.34,-0.13 11.43,-0.13 11.43,11.18 1.27,11.18 arc-90 0,12.45 0,30.23 arc-90
  pour Top (no thermals): 62.99,3.56 56.64,3.56 56.39,3.3 54.1,3.3 54.1,5.08 62.99,5.08
GPS_RX  (via drill 0.25, 0.51)
  Top 0.305: v44.7,18.8 44.7,11.68 45.72,10.67 D1.C | v25.91,22.35 25.91,22.08 26.46,21.53 IC1.12
  Bottom 0.305: v44.7,18.8 44.7,19.51 41.91,22.3 25.91,22.3 v25.91,22.35
GPS_RX_3V
  Top 0.406: ULTIMATE_GPS.P$10 47.64,12.05 D1.A R3.1
GPS_TX  (via drill 0.25, 0.51)
  Top 0.305: v48.01,19.05 48.26,18.8 48.26,14.22 48.94,13.55 ULTIMATE_GPS.P$9 | IC1.11 28.55,23.11 27.69,23.11 26.92,23.88 v26.92,24.13
  Bottom 0.305: v26.92,24.13 26.92,23.88 27.69,23.11 42.42,23.11 46.48,19.05 v48.01,19.05
GPS_V_SIG  (via drill 0.25, 0.51)
  Top 0.305: IC1.15 26.89,19.05 25.15,19.05 22.86,21.34 v21.59,21.34 | v40.13,16.76 40.43,16.47 42.71,16.47 43.11,16.07 U3.3 | v28.7,19.05 v32.26,19.05
  Bottom 0.305: v32.26,19.05 34.54,16.76 v40.13,16.76 | v21.59,21.34 22.86,21.34 25.15,19.05 v28.7,19.05
MISO
  Top 0.305: IC1.2 35.97,25.81 36.83,26.67 36.83,27.69 36.07,28.45 J2.1
MOSI
  Top 0.305: IC1.1 36.77,25.34 37.85,26.42 39.12,26.42 40.03,27.33 41.3,27.33 43.69,29.72 43.69,35.31 41.7,37.3 40.12,37.3 38.61,35.79 J2.4
N$1
  Top 0.305: R2.2 LED2.A
N$2
  Top 0.305: R6.2 25.84,9.91 24.64,9.91 24.22,10.32 24.22,12.1 23.65,12.68 LED1.A
N$3
  Top 0.406: LED3.A R8.2
N$7
  Top 0.406: U3.5 41.21,18.1 42.93,19.81 42.93,21.59 41.15,23.37 FB1.1
ONOFF  (via drill 0.51)
  Top 0.305: v38.35,24.89 38.35,21.74 IC1.44 | ROCKBLOCK.3 55.37,33.53 54.36,32.51 46.48,32.51 v45.21,31.24
  Bottom 0.305: v45.21,31.24 38.86,24.89 v38.35,24.89
RESET  (via drill 0.51)
  Top 0.305: v34.8,28.7 34.37,28.27 IC1.4 | J2.5 v41.15,28.7
  Bottom 0.305: v34.8,28.7 35.05,28.96 40.89,28.96 v41.15,28.7
RKBLK_RXD  (via drill 0.25)
  Top 0.305: IC1.13 26.01,20.73 24.89,21.84 v24.89,23.37 | v32.26,32.51 32.26,36.83 33.73,38.3 48.56,38.3 50.29,36.58 ROCKBLOCK.5
  Bottom 0.305: v24.89,23.37 24.89,25.15 v32.26,32.51
RKBLK_TXD  (via drill 0.25, 0.51)
  Top 0.305: IC1.14 25.54,19.93 23.72,21.74 v23.72,24.13 | v29.55,31.5 31.01,32.96 31.01,36.24 30.99,36.27 30.99,37.08 33.02,39.12 49.78,39.12 52.83,36.07 ROCKBLOCK.4
  Bottom 0.305: v29.55,31.5 29.55,31.46 23.72,25.63 v23.72,24.13
RKBLK_V_SIG  (via drill 0.25, 0.51)
  Top 0.305: IC1.16 24.6,18.33 22.86,20.07 v22.61,20.07 | U6.6 59.96,2.56 59.82,2.41 53.47,2.41 51.31,4.57 51.31,5.59 48.77,8.13 v34.42,8.13
  Bottom 0.305: v22.61,20.07 22.1,19.56 22.1,14.99 26.67,10.41 31.24,10.41 33.53,8.13 v34.42,8.13
RXD0
  Top 0.305: IC1.9 30.37,24.38 30.37,24.64 28.84,26.16 21.34,26.16 20.07,27.43 20.07,34.8 J3.4
SCK  (via drill 0.51)
  Top 0.305: v38.61,27.79 J2.3 | v35.56,27.18 35.17,26.78 IC1.3
  Bottom 0.305: v38.61,27.79 38.46,27.63 36.02,27.63 v35.56,27.18
SCL  (via drill 0.25)
  Top 0.305: U2.4 4.11,18.75 v3.3,19.56 | IC1.19 25.2,15.93 24.51,15.24 20.07,15.24 19.49,15.81 R5.2 18.73,15.75 v17.27,15.75
  Bottom 0.305: v17.27,15.75 7.11,15.75 v3.3,19.56
SDA  (via drill 0.25)
  Top 0.305: IC1.20 25.79,15.13 24.89,14.22 20.12,14.22 19.29,13.4 R4.2 18.35,13.4 v17.27,14.48 | U2.3 2.61,18.11 v2.54,18.03
  Bottom 0.305: v17.27,14.48 7.11,14.48 3.56,18.03 v2.54,18.03
TXD0
  Top 0.305: IC1.10 29.46,23.43 29.46,24.38 28.7,25.15 20.95,25.15 18.8,27.3 18.8,34.04 J3.5
U.FL_ANT
  Top 0.406: ULTIMATE_GPS.P$11 65.12,12.34 63.21,12.34 62.23,13.31 62.23,33.02 J4.FEED
V_BATT  (via drill 0.25, 0.35)
  Top 0.127: 58.67,6.35 59.56,6.35 | 59.96,5.95 U6.5
  Top 0.254: 59.71,5.54 59.48,5.54 58.67,6.35 | U6.8 60.96,2.03 61.47,1.52 v61.72,1.52
  Top 0.305: 14.22,37.08 16.51,39.37 R2.1 | U6.5 59.71,5.54 | 59.56,6.35 59.96,5.95
  Top 0.406: IC1.38 34.58,16.73 33.78,17.53 33.53,17.53 | 33.53,17.53 32,17.53 | 32,17.53 IC1.17 24.13,17.53 23.18,18.48 C5.1 21.78,18.54 20.32,18.54 | 33.53,17.53 33.57,17.56 IC1.5 33.57,36.54 v33.53,36.58 | 32,17.53 31.97,17.49 IC1.27 31.97,9.18 | 33.21,9.18 31.97,9.18 | 31.97,9.18 31.5,9.18 30.19,7.87 28.45,7.87 | 28.45,7.87 22.35,7.87 20.7,9.53 v20.7,12.83 | U3.1 41.21,11.43 C7.1 41.47,9.18 | 15.24,29.46 20.32,24.38 20.32,22.86 | 15.24,29.46 13.46,31.24 13.46,36.32 14.22,37.08 29.46,37.08 v31.24,38.86 32.41,40.03 63.86,40.03 68.07,35.81 68.07,11.51 67.02,10.45 56.64,10.45 | 41.47,9.18 52.32,9.18 53.59,10.45 | 33.21,9.18 33.21,7.11 34.22,6.1 | U1.1 34.22,6.1 | 33.21,9.18 41.47,9.18 | X1.2 7.78,27.18 12.95,27.18 15.24,29.46 | U4.1 16,21.18 16,21.84 16.95,22.79 C9.1 20.25,22.79 20.32,22.86 | U5.1 27.37,6.03 27.94,6.6 28.45,6.6 | C12.1 29.72,5.59 28.7,6.6 28.45,6.6 | 20.32,22.86 20.32,18.54 | 28.45,6.6 28.45,7.87 | 34.22,6.1 36.13,6.1 C11.1 | 20.32,18.54 20.33,18.53 v20.33,16.27 | ULTIMATE_GPS.P$4 52.29,21.05 v52.58,21.34 | v53.85,18.54 53.85,10.71 53.59,10.45 | 56.64,10.45 53.59,10.45 | 58.67,6.35 57.66,6.35 v57.15,6.86 56.64,7.37 56.64,7.49 | 56.64,7.49 56.64,8.38 | 56.64,8.38 56.64,10.45 | L1.P$2 56.64,8.38 | C15.1 55.62,7.49 56.64,7.49
  Bottom 0.254: v57.15,6.86 58.42,5.59 58.42,3.43 58.8,3.05 59.94,3.05 61.47,1.52 v61.72,1.52
  Bottom 0.406: v33.53,36.58 v31.24,38.86 | v20.33,16.27 20.33,13.2 v20.7,12.83 | v52.58,21.34 52.58,19.81 v53.85,18.54
  pour Top (isolate 0.305, no thermals): 60.07,5.46 58.93,5.46 58.17,6.22 54.23,6.22 54.23,7.11 55.75,8.64 55.75,10.54 56.77,10.54 56.77,9.02 58.29,9.02 58.29,7.24 58.93,6.6 59.44,6.6 60.07,5.97
V_BMP_3.3
  Top 0.305: U2.8 6.65,16.76 7.62,16.76 8.64,16.76 7.87,17.53 7.3,18.11 U2.6 | U2.2 3.99,17.46 3.3,16.76 3.3,13.97 3.81,13.46 7.37,13.46 8.13,14.22 8.13,14.99 C10.1
  Top 0.406: 14.73,16.76 13.97,16.76 8.64,16.76 8.13,16.26 8.13,14.99 | 14.73,16.76 14.73,14.99 | 14.73,14.99 C8.1 | 14.73,16.76 15.94,17.97 | 15.94,17.97 U4.5 | R4.1 18.61,11.68 17.78,11.68 16.51,12.95 16.51,13.65 15.17,14.99 14.73,14.99 | R5.1 16.19,17.71 15.94,17.97
V_CHAIN_3.3
  Top 0.406: U5.5 27.37,2.86 26.43,3.8 22.36,3.8 J1.4 22.35,6.1 21.84,6.6 C13.1
V_DS18_3.3
  Top 0.406: DS18B20.3 42.16,1.52 41.66,1.52 | R1.1 41.66,2.54 41.66,1.52 | 41.66,1.52 36.83,1.52 | 36.83,1.52 35.81,1.52 35.31,1.52 34.7,1.52 34.22,2 U1.5 | C4.1 36.64,1.71 36.83,1.52
V_FEEDBACK
  Top 0.254: U6.10 62.01,2.79 65.28,2.79 | 65.28,2.79 65.28,3.88 | 65.28,1.71 65.28,2.79
  Top 0.406: 65.28,3.88 R9.2 | R7.1 65.28,1.71
V_GPS_3.3  (via drill 0.51)
  Top 0.406: R3.2 v46.48,20.57 | FB1.2 C6.1 45.65,25.33 v45.72,25.4 45.79,25.33 C2.1 48.01,25.59 50.37,25.59 ULTIMATE_GPS.P$1
  Bottom 0.406: v46.48,20.57 45.72,21.34 v45.72,25.4
V_RKBLK  (via drill 0.35)
  Top 0.254: U6.2 61.46,6.6 | v67.56,5.59 67.06,5.08 67.06,4.13
  Top 0.305: 61.46,6.6 62.23,7.37
  Top 0.406: v61.98,11.68 60.96,12.7 60.96,21.59 57.91,24.64 ROCKBLOCK.2 | C14.1 64.04,8.68 v62.23,8.68 62.23,7.37 | R9.1 67.06,4.13
  Bottom 0.254: v62.23,8.68 65.32,5.59 v67.56,5.59
  Bottom 0.406: v61.98,11.68 62.23,11.43 v62.23,8.68
  pour Top (isolate 0.254, no thermals): 61.34,6.48 61.34,7.11 61.85,7.62 61.85,9.4 63.75,9.4 63.75,8.13 63.5,8.13 61.72,6.35 61.47,6.35
VAUX  (via drill 0.35)
  Top 0.254: 62.44,6.4 62.64,6.6 C16.1 | 62.44,6.4 61.96,5.92 U6.1 | v63.63,1.52 62.74,0.64 61.34,0.64 60.2,1.78 60.46,2.04 U6.7 | v63.63,3.81 63.63,5.21 62.44,6.4
  Bottom 0.254: v63.63,1.52 v63.63,3.81
XTAL1
  Top 0.305: IC1.8 31.17,25.73 28.77,28.12 Y2.P$1 23.63,28.12 C3.2
XTAL2
  Top 0.305: IC1.7 31.97,26.71 26.92,31.75 | Y2.P$2 26.92,31.75 | 26.92,31.75 26.85,31.75 C1.2

### Text on the board
tNames: ICE DRIFTER V0.3 02.21.2019 | MOSI | GND | RX | TX | GND | RX | TX | SLEEP | V_RBLK | GND | MISO | SCK | RST | 8MHZ | V_BATT | GND | ATMEGA 644P | RX | TX | V_CHN | V_DS18 | DATA | GND